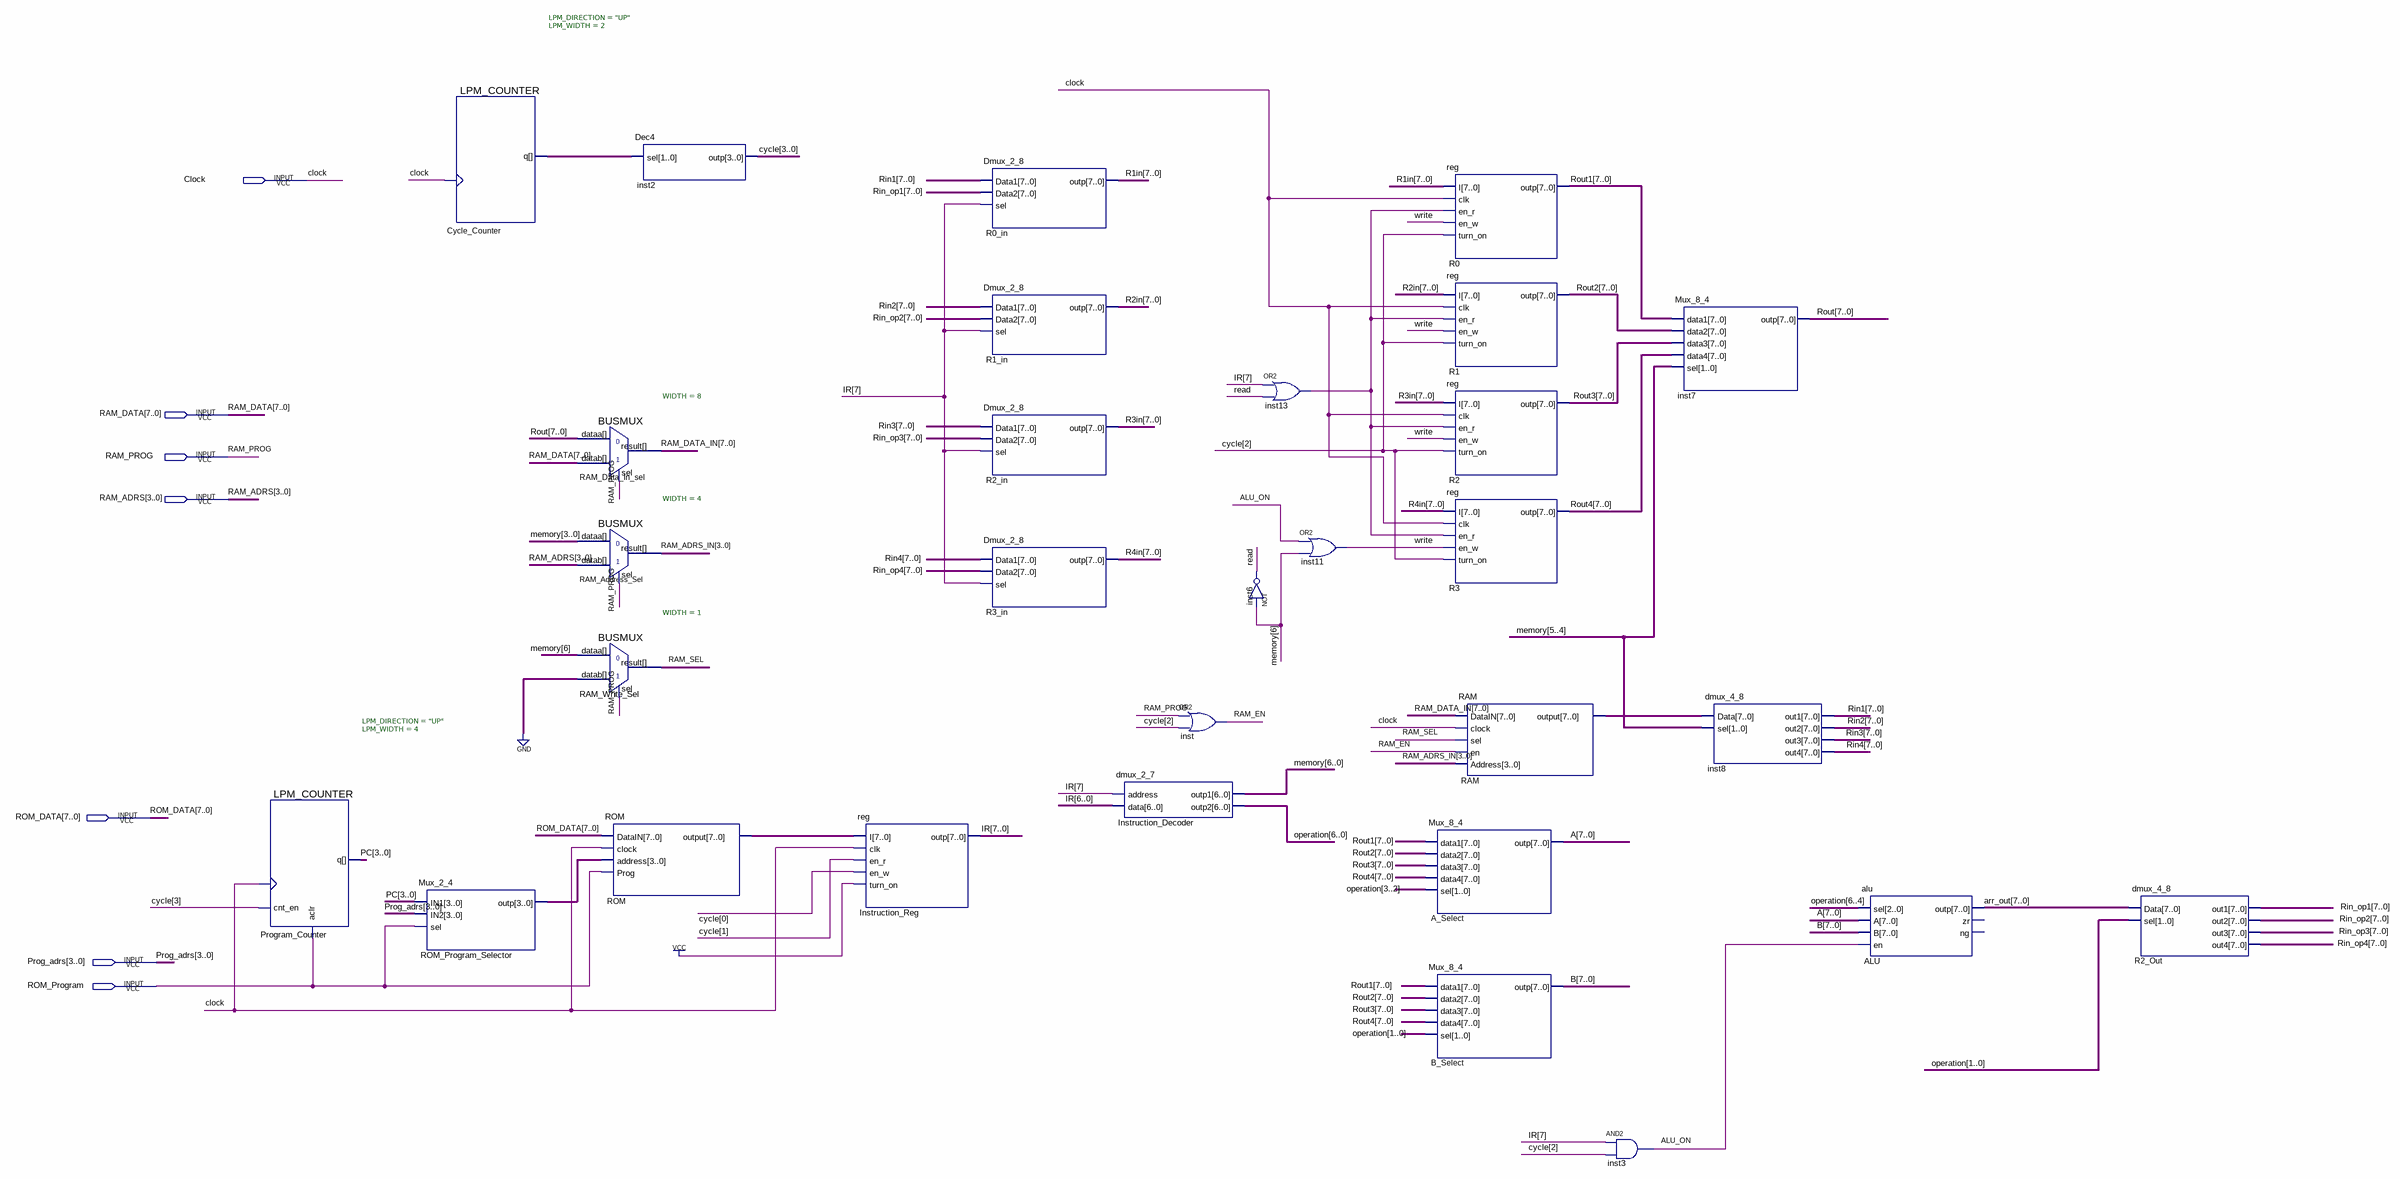
[diagram p0: schematic sheet]
// Quartus schematic cpu.bdf as structural Verilog: 30 symbols, 7 pins
module cpu (
  input  Clock,
  input  [7:0] RAM_DATA,
  input  RAM_PROG,
  input  [3:0] RAM_ADRS,
  input  [7:0] ROM_DATA,
  input  [3:0] Prog_adrs,
  input  ROM_Program
);

  wire ALU_ON, inst13_out, RAM_EN, RAM_SEL, read, write;
  wire [1:0] Cycle_Counter_q;
  wire [3:0] cycle, PC, RAM_ADRS_IN, ROM_Program_Selector_outp;
  wire [6:0] memory, operation;
  wire [7:0] A, arr_out, B, IR, R1in, R2in, R3in, R4in, RAM_DATA_IN, RAM_output, Rin1, Rin2, Rin3, Rin4,
       Rin_op1, Rin_op2, Rin_op3, Rin_op4, ROM_output, Rout, Rout1, Rout2, Rout3, Rout4;

  LPM_COUNTER #(.LPM_DIRECTION("UP"), .LPM_WIDTH(4)) Program_Counter (
    .aclr(ROM_Program), .clock(Clock), .cnt_en(cycle[3]), .q(PC));
  Mux_2_4 ROM_Program_Selector (.IN1(PC), .IN2(Prog_adrs), .sel(ROM_Program), .outp(ROM_Program_Selector_outp));
  LPM_COUNTER #(.LPM_DIRECTION("UP"), .LPM_WIDTH(2)) Cycle_Counter (.clock(Clock), .q(Cycle_Counter_q));
  BUSMUX #(.WIDTH(8)) RAM_Data_In_sel (.datab(RAM_DATA), .sel(RAM_PROG), .dataa(Rout), .result(RAM_DATA_IN));
  BUSMUX #(.WIDTH(4)) RAM_Address_Sel (.datab(RAM_ADRS), .sel(RAM_PROG), .dataa(memory[3:0]), .result(RAM_ADRS_IN));
  BUSMUX #(.WIDTH(1)) RAM_Write_Sel (.datab(1'b0), .sel(RAM_PROG), .dataa(memory[6]), .result(RAM_SEL));
  Dec4 inst2 (.sel(Cycle_Counter_q), .outp(cycle));
  ROM ROM (
    .DataIN(ROM_DATA), .clock(Clock), .address(ROM_Program_Selector_outp), .Prog(ROM_Program),
    .\output (ROM_output));
  \reg  Instruction_Reg (.I(ROM_output), .clk(Clock), .en_r(cycle[1]), .en_w(cycle[0]), .turn_on(1'b1), .outp(IR));
  Dmux_2_8 R0_in (.Data1(Rin1), .Data2(Rin_op1), .sel(IR[7]), .outp(R1in));
  Dmux_2_8 R1_in (.Data1(Rin2), .Data2(Rin_op2), .sel(IR[7]), .outp(R2in));
  Dmux_2_8 R2_in (.Data1(Rin3), .Data2(Rin_op3), .sel(IR[7]), .outp(R3in));
  Dmux_2_8 R3_in (.Data1(Rin4), .Data2(Rin_op4), .sel(IR[7]), .outp(R4in));
  dmux_2_7 Instruction_Decoder (.address(IR[7]), .data(IR[6:0]), .outp1(memory), .outp2(operation));
  or inst (RAM_EN, RAM_PROG, cycle[2]);
  not inst6 (read, memory[6]);
  or inst13 (inst13_out, IR[7], read);
  or inst11 (write, ALU_ON, memory[6]);
  \reg  R0 (.I(R1in), .clk(Clock), .en_r(inst13_out), .en_w(write), .turn_on(cycle[2]), .outp(Rout1));
  \reg  R1 (.I(R2in), .clk(Clock), .en_r(inst13_out), .en_w(write), .turn_on(cycle[2]), .outp(Rout2));
  \reg  R2 (.I(R3in), .clk(Clock), .en_r(inst13_out), .en_w(write), .turn_on(cycle[2]), .outp(Rout3));
  \reg  R3 (.I(R4in), .clk(Clock), .en_r(inst13_out), .en_w(write), .turn_on(cycle[2]), .outp(Rout4));
  Mux_8_4 A_Select (.data1(Rout1), .data2(Rout2), .data3(Rout3), .data4(Rout4), .sel(operation[3:2]), .outp(A));
  Mux_8_4 B_Select (.data1(Rout1), .data2(Rout2), .data3(Rout3), .data4(Rout4), .sel(operation[1:0]), .outp(B));
  RAM RAM (
    .DataIN(RAM_DATA_IN), .clock(Clock), .sel(RAM_SEL), .en(RAM_EN), .Address(RAM_ADRS_IN),
    .\output (RAM_output));
  and inst3 (ALU_ON, IR[7], cycle[2]);
  Mux_8_4 inst7 (.data1(Rout1), .data2(Rout2), .data3(Rout3), .data4(Rout4), .sel(memory[5:4]), .outp(Rout));
  dmux_4_8 inst8 (.Data(RAM_output), .sel(memory[5:4]), .out1(Rin1), .out2(Rin2), .out3(Rin3), .out4(Rin4));
  alu ALU (.sel(operation[6:4]), .A(A), .B(B), .en(ALU_ON), .outp(arr_out));  // open: zr, ng
  dmux_4_8 R2_Out (
    .Data(arr_out), .sel(operation[1:0]), .out1(Rin_op1), .out2(Rin_op2), .out3(Rin_op3), .out4(Rin_op4));
endmodule
